# Altium project Serial_MultiPlexer.PrjPcb
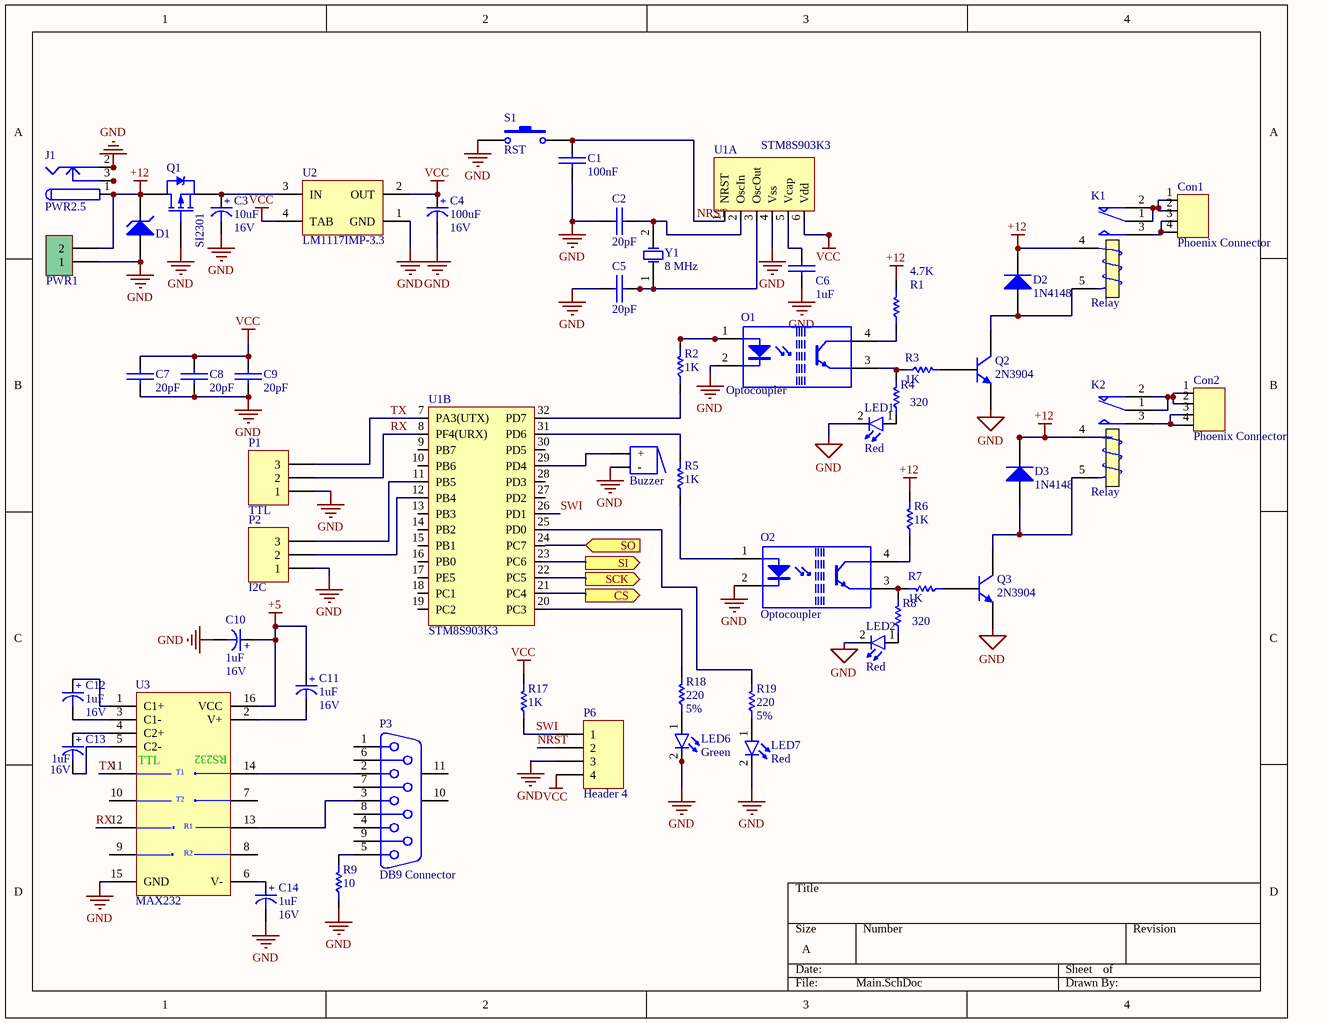
[diagram p0: Main.SchDoc]
Designer: Javad RahimiPetroudi
2 sheets, 81 parts. Net scope: flat (ports and power ports of the same name join across sheets).
Board file: main.PcbDoc
Sheets:
  Main.SchDoc
  CAN_BUS.SchDoc

## Sheet Main.SchDoc
size A; SheetNumber: 1; SheetTotal: 2

### Parts
Buzzer  Buzzer  [BUZZER]  (value not drawn)
C1  100nF  [SMD_CAP_1206]
C2  20pF  [SMD_CAP_1206]
C3  Voltage: 16V  [CAPP 1206 (3216X18L) Size A]  (hidden comment: 10uF)
C4  Voltage: 16V  [CAPP 1206 (3216X18L) Size A]  (hidden comment: 100uF)
C5  20pF  [SMD_CAP_1206]
C6  1uF  [SMD_CAP_1206]
C7  20pF  [SMD_CAP_1206]
C8  20pF  [SMD_CAP_1206]
C9  20pF  [SMD_CAP_1206]
C10  Voltage: 16V  [cap 01]  (hidden comment: 1uF)
C11  Voltage: 16V  [cap 01]  (hidden comment: 1uF)
C12  Voltage: 16V  [cap 01]  (hidden comment: 1uF)
C13  Voltage: 16V  [cap 01]  (hidden comment: 1uF)
C14  Voltage: 16V  [CAPP 1206 (3216X18L) Size A]  (hidden comment: 1uF)
Con1  Phoenix Connector  [KF2EDGRC]
Con2  Phoenix Connector  [KF2EDGRC]
D1  Diode Zener  [Diode 1W]  (value not drawn)
D2  1N4148  [Diode 1W]
D3  1N4148  [Diode 1W]
J1  PWR2.5  [KLD-0202]
K1  Relay  [Relay 15.40x12.10x13.10]
K2  Relay  [Relay 15.40x12.10x13.10]
LED1  Red  [LED-3mm]
LED2  Red  [LED-3mm]
LED6  Green  [LED-5mm]
LED7  Red  [LED-5mm]
O1  Optocoupler  [DIP4]
O2  Optocoupler  [DIP4]
P1  TTL  [HDR1X3]
P2  I2C  [HDR1X3]
P3  DB9 Connector  [DB9 Female]
P6  Header 4  [HDR1X4]
PWR1  Phoenix terminal  [Phoenix2]  (value not drawn)
Q1  SI2301  [SOT-23_M]
Q2  2N3904  [SOT23_BEC_N]
Q3  2N3904  [SOT23_BEC_N]
R1  4.7K  [Res-(1/4)]
R2  1K  [RES 1206 (3216X08L)]
R3  1K  [Res-(1/4)]
R4  320  [Res-(1/4)]
R5  1K  [RES 1206 (3216X08L)]
R6  1K  [Res-(1/4)]
R7  1K  [Res-(1/4)]
R8  320  [Res-(1/4)]
R9  10  [RES 1206 (3216X08L)]
R17  1K  [RES 1206 (3216X08L)]
R18  Tolerance: 5%  [RES 1206 (3216X08L)]  (hidden comment: 220)
R19  Tolerance: 5%  [RES 1206 (3216X08L)]  (hidden comment: 220)
S1  RST  [Switch - Push to On]
U1  STM8S903K3  [CQFP80P-32N]  (parts A,B of 2)
U2  LM1117IMP-3.3  [MP04A_N]
U3  MAX232  [SO-16]
Y1  8 MHz  [XTAL Small]

### Ports
CS (out), SCK (out), SI (out), SO (in)

### Nets
+5: C10.1(+) C11.1(+) U3.16(VCC)
+12: D1.2(K) D2.2(K) D3.2(K) J1.1 J1.1A J1.1B K1.4(T1) K2.4(T1) PWR1.2 Q1.2(D) R1.2 R6.2
GND: Buzzer.2(-) C1.2(-) C2.1(+) C3.2(-) C4.2(-) C5.1(+) C6.1(+) C7.1(+) C8.1(+) C9.1(+) C10.2(-) C14.2(-) D1.1(A) J1.2 J1.2A J1.2B LED1.2(K) LED2.2(K) LED6.2(K) LED7.2(K) O1.2(K) O2.2(K) P1.1 P2.1 P6.3 PWR1.1 Q1.1(G) Q2.2(E) Q3.2(E) R9.1 S1.1 U1.4(Vss) U2.1(GND) U3.15(GND)
VCC: C4.1(+) C7.2(-) C8.2(-) C9.2(-) P6.4 R17.2 U1.6(Vdd) U2.2(OUT) U2.4(TAB)
CS: U1.21(PC4) ; port CS
NRST: C1.1(+) P6.2 S1.2 U1.1(NRST)
RX: P1.2 U1.8(PF4(URX)) U3.12(R1OUT)
SCK: U1.22(PC5) ; port SCK
SI: U1.23(PC6) ; port SI
SO: U1.24(PC7) ; port SO
SWI: P6.1 R17.1 U1.26(PD1)
TX: P1.3 U1.7(PA3(UTX)) U3.11(T1IN)
NetBuzzer_1: Buzzer.1(+) U1.29(PD4)
NetC2_2: C2.2(-) U1.2(OscIn) Y1.2(OSC2)
NetC3_1: C3.1(+) Q1.3(S) U2.3(IN)
NetC5_2: C5.2(-) U1.3(OscOut) Y1.1(OSC1)
NetC6_2: C6.2(-) U1.5(Vcap)
NetC11_2: C11.2(-) U3.2(V+)
NetC12_1: C12.1(+) U3.1(C1+)
NetC12_2: C12.2(-) U3.3(C1-)
NetC13_1: C13.1(+) U3.4(C2+)
NetC13_2: C13.2(-) U3.5(C2-)
NetC14_1: C14.1(+) U3.6(V-)
NetCon1_1: Con1.1 Con1.2 K1.1(COM) K1.2(NC)
NetCon1_3: Con1.3 Con1.4 K1.3(NO)
NetCon2_1: Con2.1 Con2.2 K2.1(COM) K2.2(NC)
NetCon2_3: Con2.3 Con2.4 K2.3(NO)
NetD2_1: D2.1(A) K1.5(T2) Q2.3(C)
NetD3_1: D3.1(A) K2.5(T2) Q3.3(C)
NetJ1_3: J1.3 J1.3A J1.3B
NetLED1_1: LED1.1(A) R4.1
NetLED2_1: LED2.1(A) R8.1
NetLED6_1: LED6.1(A) R18.1
NetLED7_1: LED7.1(A) R19.1
NetO1_1: O1.1(A) R2.2
NetO1_3: O1.3(E) R3.1 R4.2
NetO1_4: O1.4(C) R1.1
NetO2_1: O2.1(A) R5.1
NetO2_3: O2.3(E) R7.2 R8.2
NetO2_4: O2.4(C) R6.1
NetP2_2: P2.2 U1.12(PB4)
NetP2_3: P2.3 U1.11(PB5)
NetP3_2: P3.2 U3.14(T1OUT)
NetP3_3: P3.3 U3.13(R1IN)
NetP3_5: P3.5 R9.2
NetQ2_1: Q2.1(B) R3.2
NetQ3_1: Q3.1(B) R7.1
NetR2_1: R2.1 U1.32(PD7)
NetR5_2: R5.2 U1.31(PD6)
NetR18_2: R18.2 U1.20(PC3)
NetR19_2: R19.2 U1.25(PD0)

Not connected (* = marked no-connect by the designer): P3 1 4 6 7 8 9 10(MH1) 11(MH2); U1 9(PB7) 10(PB6) 13(PB3) 14(PB2) 15(PB1) 16(PB0) 17(PE5) 18(PC1) 19(PC2) 27(PD2) 28(PD3) 30(PD5); U3 7(T2OUT) 8(R2IN) 9(R2OUT) 10(T2IN)

### Notes on the sheet
- (in symbol MAX232) TTL; RS232; T1; T2; R1; R2

### Library data of the parts
Buzzer = Buzzer: Designer: Seyed Mohsen Ghasemain; ComponentLinkURL: www.picpars.com
C1 C2 C5-C9 = Cap-Bipolar: Bipolar Capacitor; Voltage: 100V; Designer: Saeid Jorablo; Organazation: ControTec; Adding Date: 1387/12/20
  C1: VALUE: 100nF
  C2: VALUE: 20pF
  C5 C7-C9: Value: 20pF
  C6: Value: 1uF
C3 C4 C10-C14 = Cap-Polar: Polar Capacitor; Designer: Saeid Jorablo; Organazation: ControTec; Adding Date: 1387/12/20
  C3: VALUE: 10uF
  C4: Value: 100uF
  C10-C14: Value: 1uF
Con1 Con2 = Phoenix_4
D1 = Diode Zener: Zener Diode; Designer: Saeid Jorablo; Company: E.P.I.L; Voltage: 13 V; Design Date: 2011/11/02
D2 D3 = Diode 1N4148: High Conductance Fast Diode; Published: 8-Jun-2000; LatestRevisionDate: 17-Jul-2002; LatestRevisionNote: Re-released for DXP Platform.; DatasheetVersion: 1997; PackageReference: DO-35; Publisher: Altium Limited; PackageDescription: Diode, Axial; Body 3.8 x 1.9 mm (LxDia. max), Lead Dia. 0.53 mm (max); Code_JEDEC: DO-204-AH; ComponentLink1Description: Manufacturer Link; ComponentLink1URL: http://www.fairchildsemi.com/; ComponentLink2Description: Datasheet; ComponentLink2URL: http://www.fairchildsemi.com/ds/1N%2F1N4148.pdf
J1 = PWR2.5: Low Voltage Power Supply Connector; Published: 17-Dec-2003; DatasheetDocument: 09-May-2002; Publisher: Altium Limited; ComponentLink1Description: Manufacturer Link; ComponentLink1URL: http://domino.kycon.com/internet/Products.html
K1 K2 = Relay: SPDT Relay; Designer: Eng. Saeid Jorablo; Company: E.P.I.L; Design_Date: 2011/10/31
LED1 LED2 LED6 LED7 = LED: Designer: Saeid Jorablo; Organazation: ControTec; Adding Date: 1387/12/22
  LED1 LED2 LED7: Color: Red
  LED6: Color: Green
O1 O2 = PC817
P1 P2 = Header 3: Header, 3-Pin; LatestRevisionDate: 17-Jul-2002; LatestRevisionNote: Re-released for DXP Platform.; Publisher: Altium Limited
P3 = DB9 Connector: Receptacle Assembly, 9 Position, Right Angle; PackageDocument: O; Positions: 9; Published: 15-Jun-2001; LatestRevisionDate: 17-Jul-2002; LatestRevisionNote: Re-released for DXP Platform.; DatasheetDocument: 1-Sep-1999; PackageReference: 788750; Publisher: Altium Limited; Orientation: Right Angle; Gender: Receptacle
P6 = Header 4: Header, 4-Pin; LatestRevisionDate: 17-Jul-2002; LatestRevisionNote: Re-released for DXP Platform.; Publisher: Altium Limited
PWR1 = Phoenix terminal 2: Terminal 2 Pin; Designer: Seyed Mohsen Ghasemain; E-mail: picpars@gmail.com; ComponentLinkURL: www.picpars.com
Q1 = PMOS-2: P-Channel Power MOSFET; Note: Pin 4 not drawn and electrically connected to Pin 2.; Published: 8-Jun-2000; LatestRevisionDate: 17-Jul-2002; LatestRevisionNote: Re-released for DXP Platform.; DatasheetVersion: PD-9.390D; PackageVersion: Feb-1997; PackageReference: TO-220AB; Publisher: Altium Limited; PackageDescription: TO, Thru-Hole, Vertical, Heatsink Mounted; 3 In-Line Leads; Pitch 2.54 mm; ComponentLink1Description: Manufacturer Link; ComponentLink1URL: http://www.irf.com/
Q2 Q3 = NPN: NPN Bipolar Transistor; Published: 8-Jun-2000; LatestRevisionDate: 29-May-2009; LatestRevisionNote: IPC-7351 Footprint Added.; PackageVersion: Aug-1999; PackageReference: SOT-23B; Publisher: Altium Limited; PackageDescription: 3-Pin SOT-23 Package 0.95 mm Pitch, 2.4 mm Lead Span
R1-R9 R17-R19 = Resistor
  R1: Value: 4.7K
  R2 R3 R5-R7 R17: Value: 1K
  R4 R8: Value: 320
  R9: Value: 10
  R18 R19: Value: 220
S1 = Switch PB: Push Button Switch
U1 = STM8S903K3: STM8S903K3 8 bit Microcontroller
U2 = LM1117IMP-x.x: x.x Volt, 800mA Low-Dropout Linear Regulator, 4-pin SOT-223; Manufacturer: National Semiconductor; PackageTopMarking: XYTT*N05B; PowerWise: N; CompType: LDO IC; Published: 4-Dec-2008; DatasheetVersion: Apr-2006; PackageVersion: revB, Apr-2003; PackageReference: MP04A; Publisher: Altium Limited; PackageDescription: Molded SOT-223, 6.50 x 3.56 x 1.6mm Body, 4 Lead, 2.3mm Pitch; Supplier 1: Farnell; Supplier Part Number 1: 7614123; PartNumber: LM1117IMP-3.3; RoHS: N; PinCount: 4; Code_JEDEC: TO-261-AA; Code_IPC: SOT223-4; ComponentLink1Description: LM1117 Datasheet; ComponentLink1URL: http://www.national.com/ds/LM/LM1117.pdf; ComponentLink2Description: LM1117 Web Page; ComponentLink2URL: http://www.national.com/pf/LM/LM1117.html; ComponentLink3Description: MP04A Package Page; ComponentLink3URL: http://www.national.com/packaging/folders/mp04a.html
U3 = MAX232: +5V Powered, Multi-Channel RS-232 Driver/Receiver; ComponentAuthor: Saeid Jorablo; ComponentLink1Description: Datasheet; ComponentLink1URL: http://pdfserv.maxim-ic.com/en/ds/MAX220-MAX249.pdf
Y1 = XTAL: XTAL Crystal; Company: E.P.I.L; Design Date: 11/04/2011; Value: 8 MHz

## Sheet CAN_BUS.SchDoc
size A3; SheetNumber: 2; SheetTotal: 2
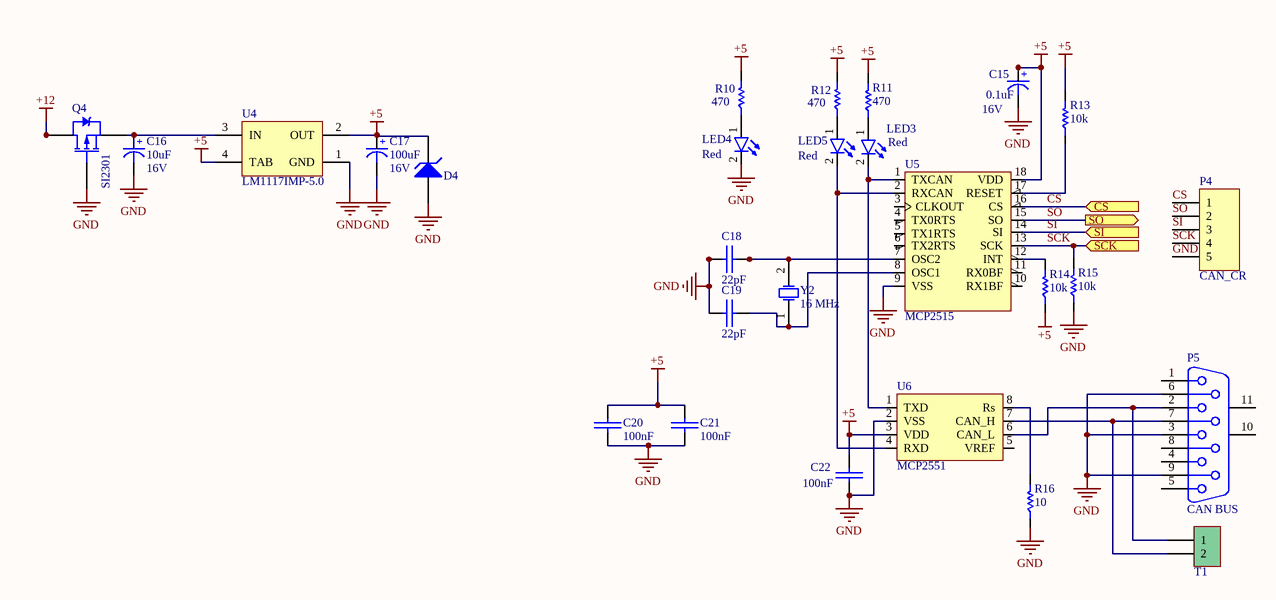
[diagram p1: CAN_BUS.SchDoc]

### Parts
C15  Voltage: 16V  [CAPP 1206 (3216X18L) Size A]  (hidden comment: 0.1uF)
C16  Voltage: 16V  [CAPP 1206 (3216X18L) Size A]  (hidden comment: 10uF)
C17  Voltage: 16V  [CAPP 1206 (3216X18L) Size A]  (hidden comment: 100uF)
C18  22pF  [SMD_CAP_1206]
C19  22pF  [SMD_CAP_1206]
C20  100nF  [SMD_CAP_1206]
C21  100nF  [SMD_CAP_1206]
C22  100nF  [SMD_CAP_1206]
D4  Diode Zener  [Diode 1W]  (value not drawn)
LED3  Red  [LED-5mm]
LED4  Red  [LED-5mm]
LED5  Red  [LED-5mm]
P4  CAN_CR  [HDR1X5]
P5  CAN BUS  [DB9 Female]
Q4  SI2301  [SOT-23_M]
R10  470  [RES 1206 (3216X08L)]
R11  470  [RES 1206 (3216X08L)]
R12  470  [RES 1206 (3216X08L)]
R13  10k  [RES 1206 (3216X08L)]
R14  10k  [RES 1206 (3216X08L)]
R15  10k  [RES 1206 (3216X08L)]
R16  10  [RES 1206 (3216X08L)]
T1  Phoenix terminal  [Phoenix2]  (value not drawn)
U4  LM1117IMP-5.0  [MP04A_N]
U5  MCP2515  [SOIC18-N]
U6  MCP2551  [SOIC8]
Y2  16 MHz  [XTAL]

### Ports
CS (in), SCK (in), SI (in), SO (out)

### Nets
+5: C15.1(+) C17.1(+) C20.1(+) C21.1(+) C22.1(+) D4.2(K) R10.2 R11.2 R12.2 R13.2 R14.1 U4.2(OUT) U4.4(TAB) U5.18(VDD) U6.3(VDD)
+12: Q4.2(D)
GND: C15.2(-) C16.2(-) C17.2(-) C18.1(+) C19.1(+) C20.2(-) C21.2(-) C22.2(-) D4.1(A) LED4.2(K) P4.5 P5.3 P5.6 P5.9 Q4.1(G) R15.1 R16.1 U4.1(GND) U5.9(VSS) U6.2(VSS)
CS: P4.1 U5.16(CS) ; port CS
SCK: P4.4 R15.2 U5.13(SCK) ; port SCK
SI: P4.3 U5.14(SI) ; port SI
SO: P4.2 U5.15(SO) ; port SO
NetC16_1: C16.1(+) Q4.3(S) U4.3(IN)
NetC18_2: C18.2(-) U5.7(OSC2) Y2.2(OSC2)
NetC19_2: C19.2(-) U5.8(OSC1) Y2.1(OSC1)
NetLED3_1: LED3.1(A) R11.1
NetLED3_2: LED3.2(K) U5.1(TXCAN) U6.1(TXD)
NetLED4_1: LED4.1(A) R10.1
NetLED5_1: LED5.1(A) R12.1
NetLED5_2: LED5.2(K) U5.2(RXCAN) U6.4(RXD)
NetP5_2: P5.2 T1.1 U6.6(CAN_L)
NetP5_7: P5.7 T1.2 U6.7(CAN_H)
NetR13_1: R13.1 U5.17(RESET)
NetR14_2: R14.2 U5.12(INT)
NetR16_2: R16.2 U6.8(Rs)

Not connected (* = marked no-connect by the designer): P5 1 4 5 8 10(MH1) 11(MH2); U5 3(CLKOUT) 4(TX0RTS) 5(TX1RTS) 6(TX2RTS) 10(RX1BF) 11(RX0BF); U6 5(VREF)

### Library data of the parts
C15-C17 = Cap-Polar: as C3 on sheet Main; Adding Date: 1387/12/20
  C15: Value: 0.1uF
  C16: VALUE: 10uF
  C17: Value: 100uF
C18-C22 = Cap-Bipolar: as C1 on sheet Main; Adding Date: 1387/12/20
  C18 C19: Value: 22pF
  C20-C22: Value: 100nF
D4 = Diode Zener: Zener Diode; Designer: Saeid Jorablo; Company: E.P.I.L; Voltage: 5 V; Design Date: 2011/11/02
LED3-LED5 = LED: as LED1 on sheet Main; Adding Date: 1387/12/22; Color: Red
P4 = Header 5: Header, 5-Pin; LatestRevisionDate: 17-Jul-2002; LatestRevisionNote: Re-released for DXP Platform.; Publisher: Altium Limited
P5 = DB9 Connector: as P3 on sheet Main; Published: 15-Jun-2001; LatestRevisionDate: 17-Jul-2002; LatestRevisionNote: Re-released for DXP Platform.; DatasheetDocument: 1-Sep-1999; PackageReference: 788750; Publisher: Altium Limited; Orientation: Right Angle; Gender: Receptacle
Q4 = PMOS-2: as Q1 on sheet Main; Published: 8-Jun-2000; LatestRevisionDate: 17-Jul-2002; LatestRevisionNote: Re-released for DXP Platform.; DatasheetVersion: PD-9.390D; PackageVersion: Feb-1997; PackageReference: TO-220AB; Publisher: Altium Limited; PackageDescription: TO, Thru-Hole, Vertical, Heatsink Mounted; 3 In-Line Leads; Pitch 2.54 mm; ComponentLink1Description: Manufacturer Link; ComponentLink1URL: http://www.irf.com/
R10-R16 = Resistor
  R10-R12: Value: 470
  R13-R15: Value: 10k
  R16: Value: 10
T1 = Phoenix terminal 2: as PWR1 on sheet Main; ComponentLinkURL: www.picpars.com
U4 = LM1117IMP-x.x: 5 Volt, 800mA Low-Dropout Linear Regulator, 4-pin SOT-223; PartNumber: LM1117IMP-3.3; Manufacturer: National Semiconductor; PackageTopMarking: XYTT*N05B; PowerWise: N; CompType: LDO IC; Published: 4-Dec-2008; DatasheetVersion: Apr-2006; PackageVersion: revB, Apr-2003; PackageReference: MP04A; Publisher: Altium Limited; PackageDescription: Molded SOT-223, 6.50 x 3.56 x 1.6mm Body, 4 Lead, 2.3mm Pitch; Supplier 1: Farnell; Supplier Part Number 1: 7614123; RoHS: N; PinCount: 4; Code_JEDEC: TO-261-AA; Code_IPC: SOT223-4; ComponentLink1Description: LM1117 Datasheet; ComponentLink1URL: http://www.national.com/ds/LM/LM1117.pdf; ComponentLink2Description: LM1117 Web Page; ComponentLink2URL: http://www.national.com/pf/LM/LM1117.html; ComponentLink3Description: MP04A Package Page; ComponentLink3URL: http://www.national.com/packaging/folders/mp04a.html
U5 = MCP2515: CAN Bus controller
U6 = MCP2551: CAN Bus controller
Y2 = XTAL: XTAL Crystal; Company: E.P.I.L; Design Date: 11/04/2011; Value: 16 MHz

## Nets that join several sheets
+5: Main (C10.1 C11.1 U3.16), CAN_BUS (15 pins)
+12: Main (12 pins), CAN_BUS (Q4.2)
GND: Main (34 pins), CAN_BUS (20 pins)
CS: Main (U1.21), CAN_BUS (P4.1 U5.16)
SCK: Main (U1.22), CAN_BUS (P4.4 R15.2 U5.13)
SI: Main (U1.23), CAN_BUS (P4.3 U5.14)
SO: Main (U1.24), CAN_BUS (P4.2 U5.15)